# EAGLE design i2c_hub (EAGLE 5.09)
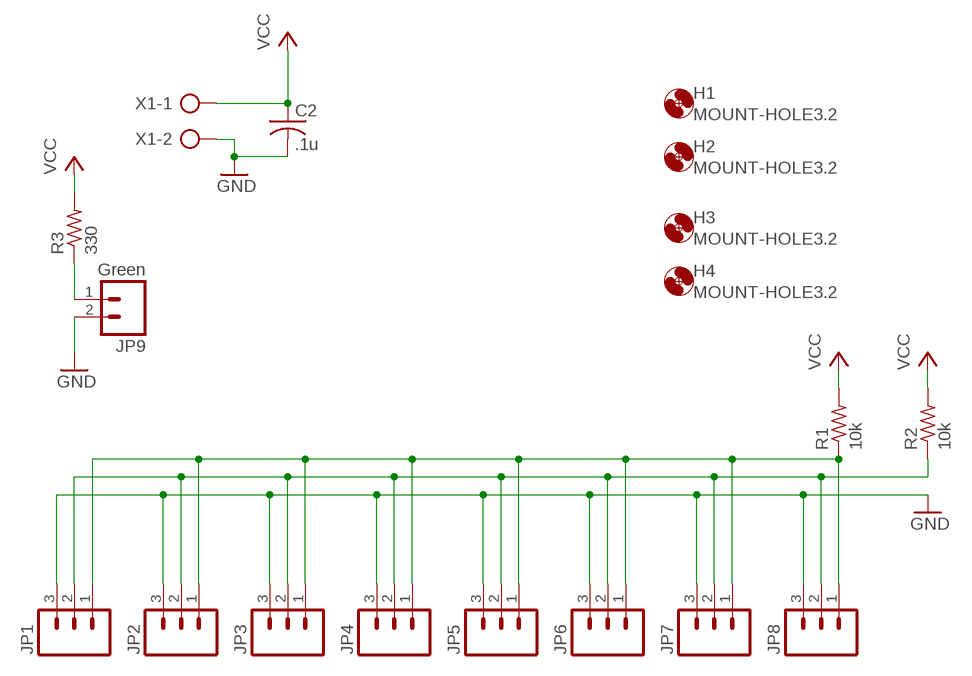
[diagram p0: schematic, sheet 1]

## Parts
C2  .1u  C-US025-050X050  [C025-050X050]
H1  MOUNT-HOLE3.2  [3,2]
H2  MOUNT-HOLE3.2  [3,2]
H3  MOUNT-HOLE3.2  [3,2]
H4  MOUNT-HOLE3.2  [3,2]
JP1  M03POLAR  [MOLEX-1X3]
JP2  M03POLAR  [MOLEX-1X3]
JP3  M03POLAR  [MOLEX-1X3]
JP4  M03POLAR  [MOLEX-1X3]
JP5  M03POLAR  [MOLEX-1X3]
JP6  M03POLAR  [MOLEX-1X3]
JP7  M03POLAR  [MOLEX-1X3]
JP8  M03POLAR  [MOLEX-1X3]
JP9  Green  M02  [1X02_LONGPADS]
R1  10k  R-US_0207/10  [0207/10]
R2  10k  R-US_0207/10  [0207/10]
R3  330  R-US_0207/10  [0207/10]
X1  AK300/2  [AK300/2]

## Nets
GND: C2.2 JP1.3 JP2.3 JP3.3 JP4.3 JP5.3 JP6.3 JP7.3 JP8.3 JP9.2 X1.2
N$1: JP9.1 R3.1
N$2: JP1.1 JP2.1 JP3.1 JP4.1 JP5.1 JP6.1 JP7.1 JP8.1 R1.1
N$3: JP1.2 JP2.2 JP3.2 JP4.2 JP5.2 JP6.2 JP7.2 JP8.2 R2.1
VCC: C2.1 R1.2 R2.2 R3.2 X1.1

## Library data of the parts
C2 = resistor:C-US: CAPACITOR, American symbol
H1-H4 = holes:MOUNT-HOLE: MOUNTING HOLE with drill center marker
JP1-JP8 = SparkFun:M03: Header 3 Standard 3-pin 0.1" header. Use with straight break away headers (SKU : PRT-00116), right angle break away headers (PRT-00553), swiss pins (PRT-00743), machine pins (PRT-00117), and female headers (PRT-00115). Molex polarized connector foot print use with SKU : PRT-08232 with associated crimp pins and housings.
JP9 = SparkFun:M02: Header 2 Standard 2-pin 0.1" header. Use with straight break away headers (SKU : PRT-00116), right angle break away headers (PRT-00553), swiss pins (PRT-00743), machine pins (PRT-00117), and female headers (PRT-00115). Molex polarized connector foot print use with SKU : PRT-08233 with associated crimp pins and housings.
R1-R3 = resistor:R-US_: RESISTOR, American symbol
X1 = con-ptr500:AK300/2: CONNECTOR

## Board
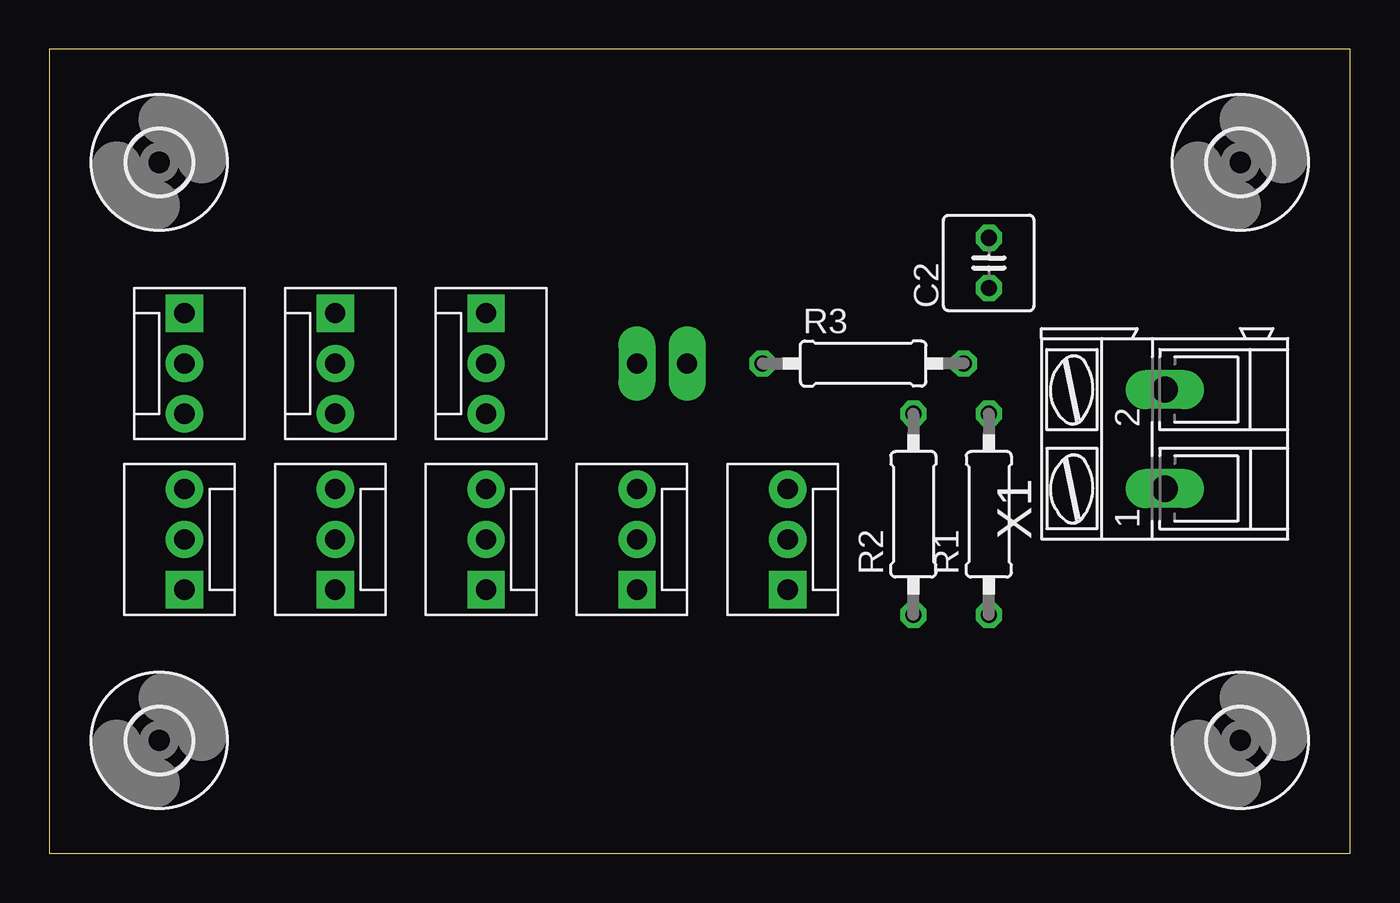
[diagram p1: board, top side]
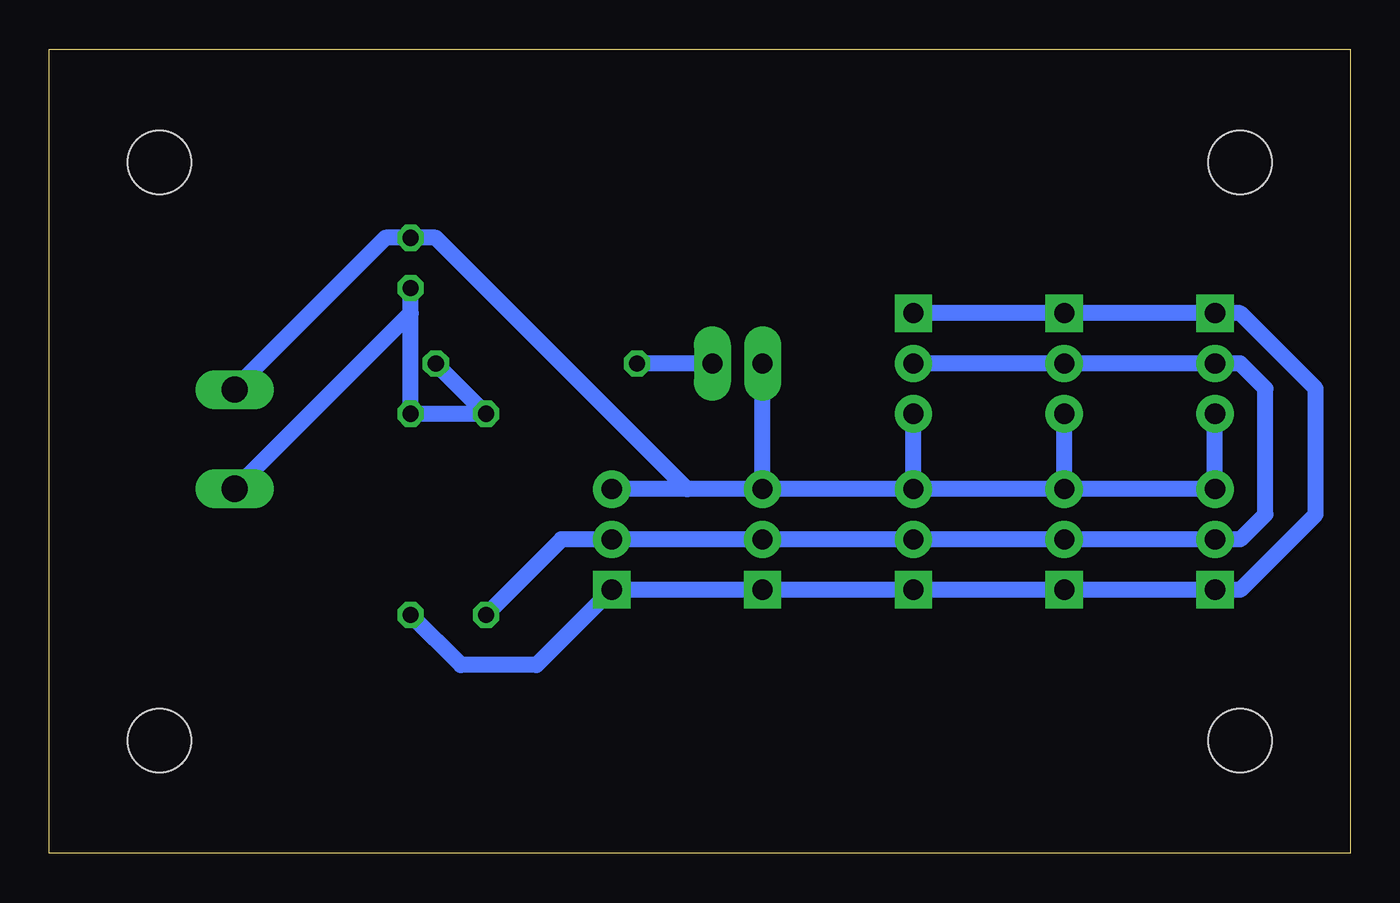
[diagram p2: board, bottom side, seen from below]

Size 65.71 x 40.63 mm. Coordinates in mm from the lower left corner, seen from the top.
Outline: 0,0 65.71,0 65.71,40.63 0,40.63 0,0
Copper layers (1*16): Top 0.035mm / dielectric 1.5mm / Bottom 0.035mm
Design rules "default *": minimum track width 32mil, minimum drill 24mil, track to track 30mil, track to pad 30mil, pad to pad 30mil, via to via 30mil, smd to smd 8mil, copper to edge 40mil, drill to drill 8mil, minimum pad ring 10mil, minimum via ring 8mil, stop-mask expansion 4mil, vias tented up to drill 0mil, thermal gap 10mil

### Footprints (pad centres in the part's own frame; a part is rotated, then mirrored left to right if it is on the bottom)
C025-050X050 = drill 0.813 octagon: 1 -1.27,0; 2 1.27,0
3,2 = hole 3.2: 0,0
MOLEX-1X3 = drill 1.016 pad 1.88 square: 1 0,0 | drill 1.016 pad 1.88 round: 2 2.54,0; 3 5.08,0
1X02_LONGPADS = drill 1.016 pad 1.88 long: 1 0,0; 2 2.54,0
0207/10 = drill 0.813 octagon: 1 -5.08,0; 2 5.08,0
AK300/2 = drill 1.321 long: 1 -2.515,0; 2 2.489,0

### Placement (x,y rotation side)
C2  47.46,29.84 90 top
H1  5.55,34.92 0 top
H2  5.55,5.71 0 top
H3  60.16,5.71 0 top
H4  60.16,34.92 0 top
JP1  37.3,13.33 90 top
JP2  6.82,27.3 270 top
JP3  14.44,27.3 270 top
JP4  22.06,27.3 270 top
JP5  6.82,13.33 90 top
JP6  14.44,13.33 90 top
JP7  22.06,13.33 90 top
JP8  29.68,13.33 90 top
JP9  32.22,24.76 180 top
R1  47.46,17.14 90 top
R2  43.65,17.14 90 top
R3  41.11,24.76 0 top
X1  56.35,20.95 90 top

### Tracks (layer width: path | path; a pad name or v marks a point on that pad's centre or on a via)
GND
  Bottom 0.813: X1.2 56.35,23.49 48.73,31.11 C2.2 46.19,31.11 33.49,18.41 | JP8.3 JP9.2 | JP8.3 33.49,18.41 | 33.49,18.41 JP1.3 | JP7.3 JP4.3 | JP2.3 JP5.3 JP6.3 | JP6.3 JP3.3 | JP6.3 JP7.3 | JP7.3 JP8.3
N$1
  Bottom 0.813: JP9.1 R3.1
N$2
  Bottom 0.813: JP4.1 JP3.1 JP2.1 5.55,27.3 1.74,23.49 1.74,17.14 5.55,13.33 JP5.1 JP6.1 JP7.1 JP8.1 JP1.1 41.11,9.52 44.92,9.52 R1.1
N$3
  Bottom 0.813: JP4.2 JP3.2 JP2.2 5.55,24.76 4.28,23.49 4.28,17.14 5.55,15.87 JP5.2 JP6.2 JP7.2 JP8.2 JP1.2 39.84,15.87 R2.1
VCC
  Bottom 0.813: R3.2 R2.2 R1.2 47.46,27.3 | 47.46,27.3 C2.1 | 47.46,27.3 56.35,18.41 X1.1